# Altium schematic sheet SmartTokens Peripherals.SchDoc: SmartTokens - Peripherals
size A4; Author: Mathieu Le Goc; DocumentNumber: 2; Revision: v1.0; SheetNumber: 2; SheetTotal: 2; PageSetup: Record=PageOptions|CenterHorizontal=True|CenterVertical=True|PrintScale=1.09|XCorrection=1.00|YCorrection=1.00|PrintKind=1|BorderSize=5000000|LeftOffset=0|BottomOffset=0|Orientation=2|PaperLength=1000|PaperWidth=1000|Scale=100|PaperSource=7|PrintQuality=-4|MediaType=1|DitherType=10|PrintScaleMode=1|PaperKind=A4|PaperIndex=9; VersionControl_RevNumber: v1.0; ProjectName: SmartTokens
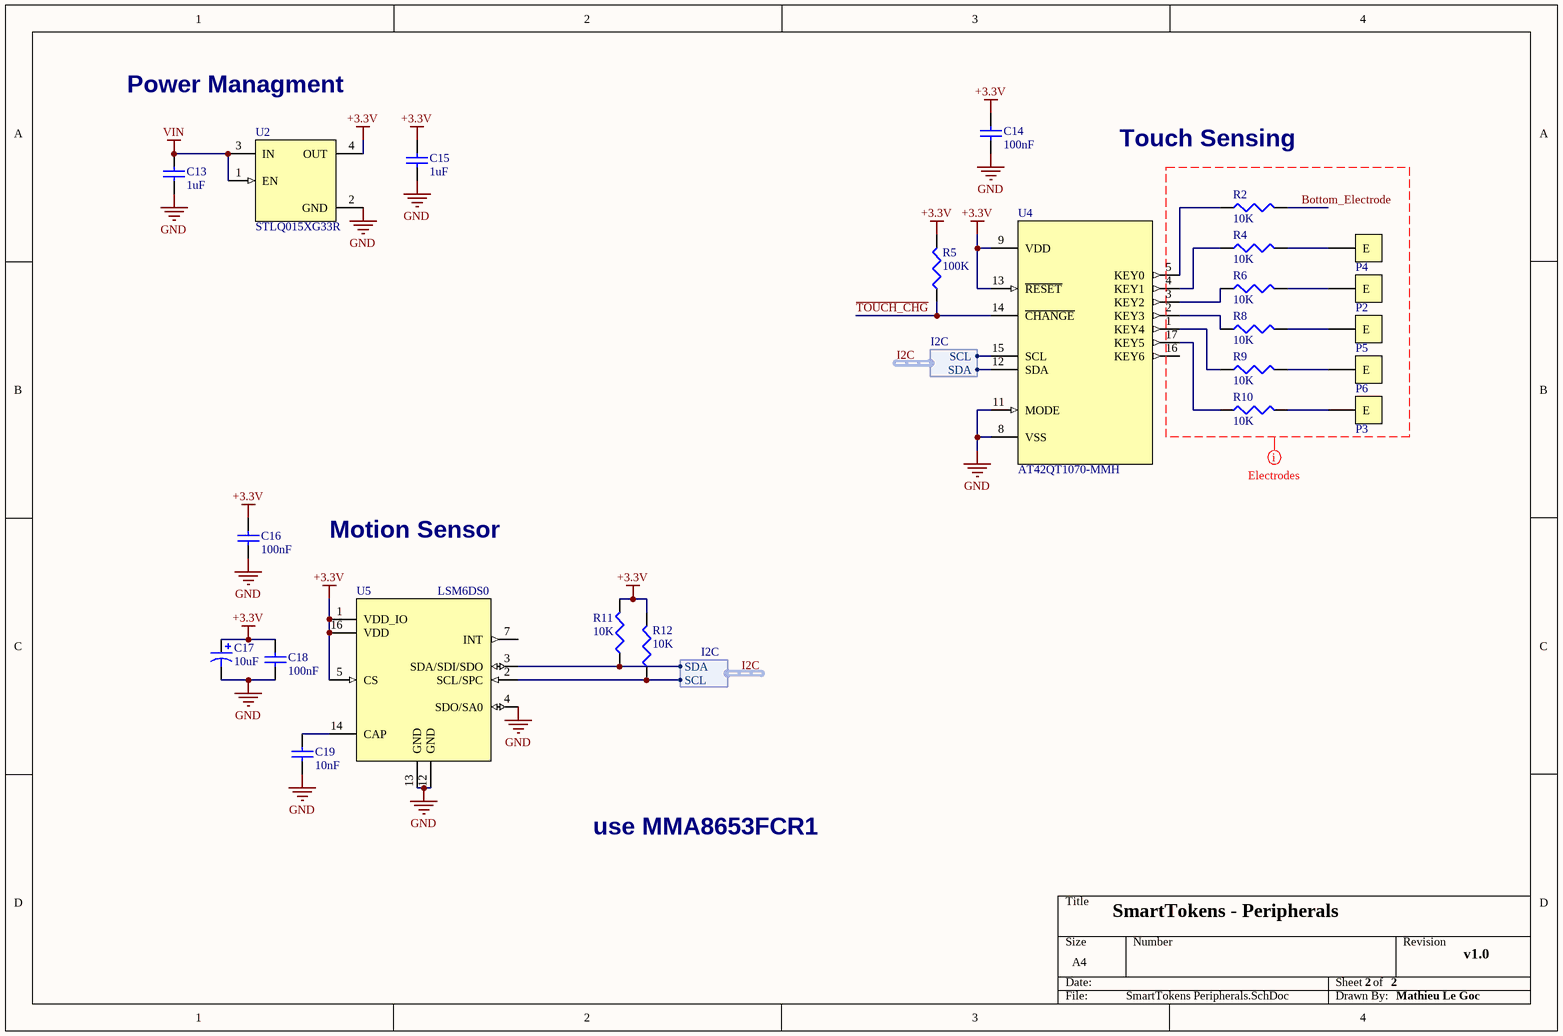
[diagram p0: SmartTokens Peripherals.SchDoc]

## Parts
C13  1uF  [0603]
C14  value 100nF  [0402]  (hidden comment: 100nF 0402 X7R 16V ±10%)
C15  1uF  [0603]
C16  value 100nF  [0402]  (hidden comment: 100nF 0402 X7R 16V ±10%)
C17  value 10uF  [0603_POLARIZED]  (hidden comment: 10uF TANTALUM)
C18  value 100nF  [0402]  (hidden comment: 100nF 0402 X7R 16V ±10%)
C19  10nF  [0402]
P2  TOUCH_ELECTRODE_PAD  [TOUCH_ELECTRODES_PADS]  (value not drawn)
P3  TOUCH_ELECTRODE_PAD  [TOUCH_ELECTRODES_PADS]  (value not drawn)
P4  TOUCH_ELECTRODE_PAD  [TOUCH_ELECTRODES_PADS]  (value not drawn)
P5  TOUCH_ELECTRODE_PAD  [TOUCH_ELECTRODES_PADS]  (value not drawn)
P6  TOUCH_ELECTRODE_PAD  [TOUCH_ELECTRODES_PADS]  (value not drawn)
R2  value 10K  [0402]  (hidden comment: 10K 0402 1/16W ±1%)
R4  value 10K  [0402]  (hidden comment: 10K 0402 1/16W ±1%)
R5  value 100K  [0402]  (hidden comment: 100K 0402 1/16W ±1%)
R6  value 10K  [0402]  (hidden comment: 10K 0402 1/16W ±1%)
R8  value 10K  [0402]  (hidden comment: 10K 0402 1/16W ±1%)
R9  value 10K  [0402]  (hidden comment: 10K 0402 1/16W ±1%)
R10  value 10K  [0402]  (hidden comment: 10K 0402 1/16W ±1%)
R11  value 10K  [0402]  (hidden comment: 10K 0402 1/16W ±1%)
R12  value 10K  [0402]  (hidden comment: 10K 0402 1/16W ±1%)
U2  STLQ015XG33R  [SOT666]
U4  AT42QT1070-MMH  [QFN45P300X300X85_HS-21L]
U5  LSM6DS0  [LGA300X300X86-16L]

## Harnesses
I2C: SDA, SCL

## Nets
+3.3V: C14.2 C15.2 C16.2 C17.1 C18.2 R5.2 R11.2 R12.2 U2.4(OUT) U4.9(VDD) U4.13(~{RESET}) U5.1(VDD_IO) U5.5(CS) U5.15(RES) U5.16(VDD)
GND: C13.1 C14.1 C15.1 C16.1 C17.2 C18.1 C19.1 U2.2(GND) U4.8(VSS) U4.11(MODE) U4.21(PAD) U5.4(SDO/SA0) U5.8(RES) U5.9(RES) U5.10(RES) U5.11(RES) U5.12(GND) U5.13(GND)
VIN: C13.2 U2.1(EN) U2.3(IN)
Bottom_Electrode: R2.2
I2C.SCL: R12.1 U4.15(SCL) U5.2(SCL/SPC) ; harness I2C.SCL
I2C.SDA: R11.1 U4.12(SDA) U5.3(SDA/SDI/SDO) ; harness I2C.SDA
~{TOUCH_CHG}: R5.1 U4.14(~{CHANGE})
NetC19_2: C19.2 U5.14(CAP)
NetP2_1: P2.1(E) R6.2
NetP3_1: P3.1(E) R10.2
NetP4_1: P4.1(E) R4.2
NetP5_1: P5.1(E) R8.2
NetP6_1: P6.1(E) R9.2
NetR2_1: R2.1 U4.5(KEY0)
NetR4_1: R4.1 U4.4(KEY1)
NetR6_1: R6.1 U4.3(KEY2)
NetR8_1: R8.1 U4.2(KEY3)
NetR9_1: R9.1 U4.1(KEY4)
NetR10_1: R10.1 U4.17(KEY5)

Not connected (* = marked no-connect by the designer): U2 5(NC) 6(NC); U4 6(NC) 7(NC) 10(NC) 16(KEY6) 18(NC) 19(NC) 20(NC); U5 6(RES) 7(INT)

## Layout directives
net class Electrodes: Bottom_Electrode

## Notes on the sheet
- Power Managment
- Touch Sensing
- Motion Sensor
- use MMA8653FCR1

## Library data of the parts
C13 C15 = 1uF: 1uF 0603 X5R 10V ±10%; Supplier 1: Farnell; Supplier Part Number 1: 1759399; Supplier 2: Digi-Key; Supplier Part Number 2: 478-1251-1-ND; Value: 1uF
C14 C16 C18 = 100nF (cheap): Supplier 1: Farnell; Supplier Part Number 1: 1288252; Supplier 2: Digi-Key; Supplier Part Number 2: 399-3521-1-ND
C17 = 10uF TANTALUM: 10uF 0603 TANTALUM 10V ±20%; Supplier 1: Farnell; Supplier Part Number 1: 2408423; Supplier 2: Digi-Key; Supplier Part Number 2: 478-9527-1-ND
C19 = 10nF: 10nF 0402 X7R 25V ±5%; Supplier 1: Farnell; Supplier Part Number 1: 1692285; Supplier 2: Digi-Key; Supplier Part Number 2: 399-1279-1-ND; Value: 10nF
P2-P6 = TOUCH_ELECTRODE_PAD: Copper Pad to solder Touch Electrode
R2 R4 R6 R8-R12 = 10K: Supplier 1: Farnell; Supplier Part Number 1: 2072517; Supplier 2: Digi-Key; Supplier Part Number 2: 541-10.0KLCT-ND
R5 = 100K: Supplier 1: Farnell; Supplier Part Number 1: 2072519; Supplier 2: Digi-Key; Supplier Part Number 2: 541-100KLCT-ND
U2 = STLQ015XG33R: STMicroelectronics 150 mA ultra low quiescent current linear voltage regulator; Supplier 1: Digi-Key; Supplier 2: Farnell; Supplier Part Number 1: 497-10530-1-ND; Supplier Part Number 2: 2311337
U4 = AT42QT1070-MMH: Atmel Seven-channel QTouch® Touch Sensor IC; Supplier 1: Digi-Key; Supplier Part Number 1: AT42QT1070-MMHCT-ND
U5 = LSM6DS0: STMicroelectronics iNEMO inertial module:   3D accelerometer and 3D gyroscope; Supplier 1: Digi-Key; Supplier Part Number 1: 497-14855-1-ND